# Altium schematic sheet Memory.SchDoc
size A; SheetNumber: 8; SheetTotal: 8
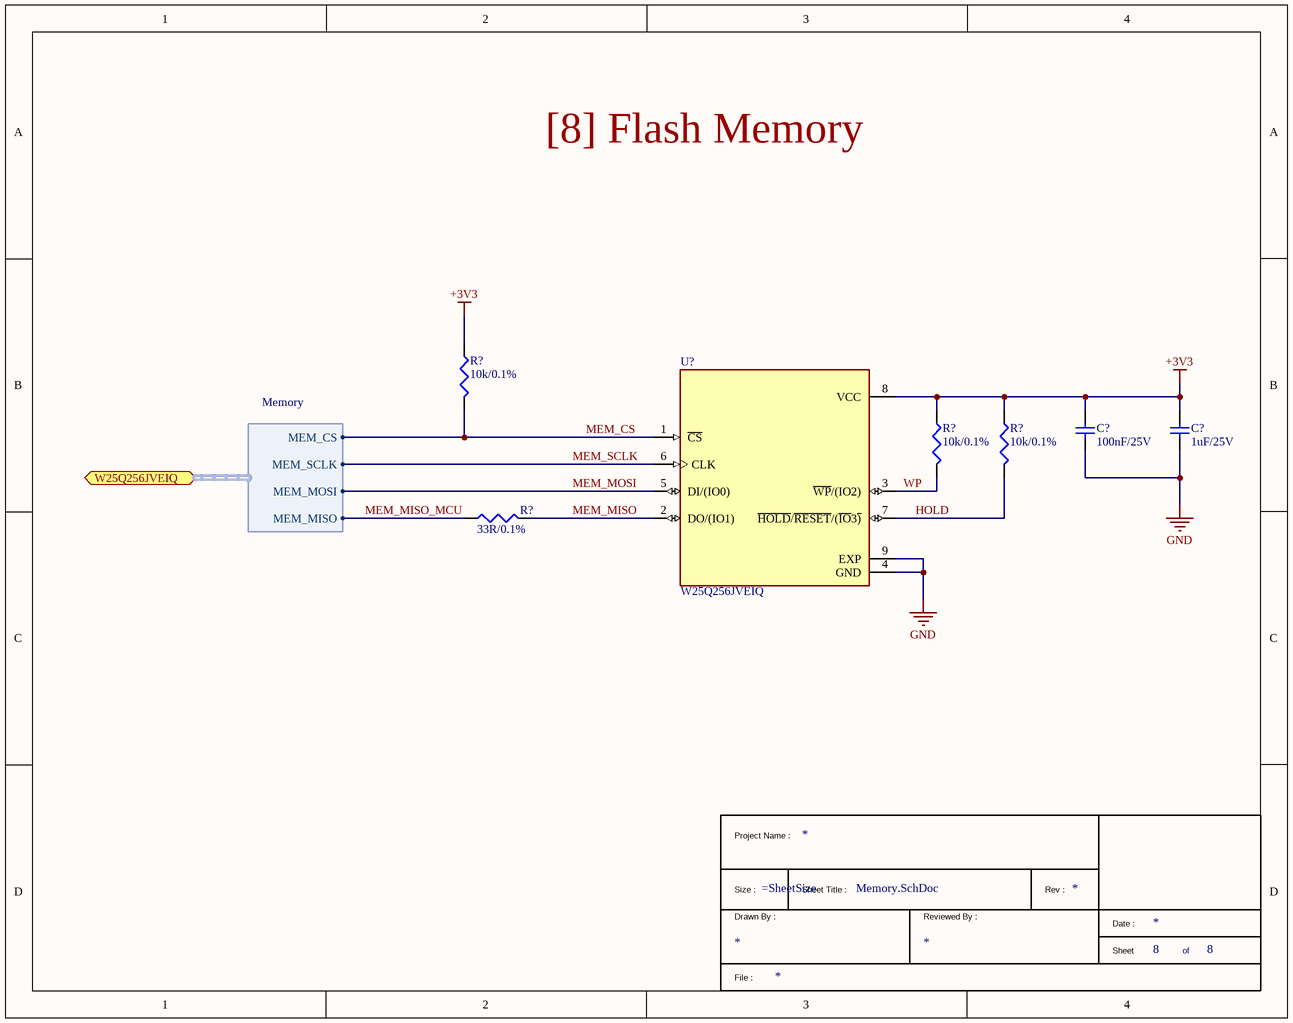
[diagram p0: Memory.SchDoc]

## Parts
(Parts that share a designator on the sheet are numbered #1, #2 ... from top to bottom, then left to right.)
*  TitleBlock1  (value not drawn)  (graphical)
C?#1  100nF/25V  [CAP_0402]
C?#2  1uF/25V  [CAP_0805]
R?#1  10k/0.1%  [RES_0402]
R?#2  10k/0.1%  [RES_0402]
R?#3  10k/0.1%  [RES_0402]
R?#4  33R/0.1%  [RES_0402]
U?  W25Q256JVEIQ  [W25Q256JVEIQ_WSON-8-EP(6x8)]

## Ports
W25Q256JVEIQ (bidir, harness Memory)

## Harnesses
Memory: MEM_SCLK, MEM_MOSI, MEM_CS, MEM_MISO

## Nets
+3V3: C?#1.2 C?#2.2 R?#1.1 R?#2.1 R?#3.1 U?.8(VCC)
GND: C?#1.1 C?#2.1 U?.4(GND) U?.9(EXP)
HOLD: R?#3.2 U?.7(~{HOLD}/~{RESET}/(~{IO}3~{)})
MEM_CS: R?#1.2 U?.1(~{CS}) ; port W25Q256JVEIQ.MEM_CS
MEM_MISO: R?#4.2 U?.2(DO/(IO1))
MEM_MISO_MCU: R?#4.1 ; port W25Q256JVEIQ.MEM_MISO
MEM_MOSI: U?.5(DI/(IO0)) ; port W25Q256JVEIQ.MEM_MOSI
MEM_SCLK: U?.6(CLK) ; port W25Q256JVEIQ.MEM_SCLK
WP: R?#2.2 U?.3(~{WP}/(IO2))

## Notes on the sheet
- [8] Flash Memory
- (in symbol TitleBlock1) Project Name :; Size :; Sheet Title :; Rev :; Drawn By :; Reviewed By :; Date :; Sheet; of; File :

## Library data of the parts
C?#1 = YAGEO CC0402JRX7R8BB104: 100nF ±5% 25V Ceramic Capacitor X7R 0402; Manufacturer: YAGEO; Manufacturer Part Number: CC0402JRX7R8BB104; LCSC Part Number: C541465; Package: 0402; Mounting Type: SMD; ComponentLink2Description: Digikey Link; ComponentLink3Description: LCSC Link; ComponentLink3URL: https://www.lcsc.com/product-detail/C541465.html?spm=wm.fly.bg.0.xh___wm.fly.dhl.mly.12-0-4&lcsc_vid=QlAIX1RQQQJfX1VRTwcNAQJXTlRaUQBVEQBYAwJfFFcxVlNRQFhYU1xWRFVdXztW
C?#2 = YAGEO CC0805KKX7R8BB105: 1uF ±10% 25V Ceramic Capacitor X7R 0805; Manufacturer: YAGEO; Manufacturer Part Number: CC0805KKX7R8BB105; LCSC Part Number: C91186; Package: 0805; Mounting Type: SMD; ComponentLink2Description: Digikey Link; ComponentLink3Description: LCSC Link; ComponentLink3URL: https://www.lcsc.com/product-detail/C91186.html?spm=wm.fly.bg.0.xh___wm.fly.dhl.mly.12-0-4&lcsc_vid=QlAIX1RQQQJfX1VRTwcNAQJXTlRaUQBVEQBYAwJfFFcxVlNRT1FbV1FfR1JZUDsOAxUeFF5JWBYZEEoKFBINSQcJGk4dAgUUFAk%3D
R?#1-R?#3 = YAGEO RT0402BRD0710KL: 62.5mW 10kΩ 50V Thin Film Resistor ±25ppm/℃ ±0.1% 0402 Chip Resistor - Surface Mount RoHS; Manufacturer: YAGEO; Manufacturer Part Number: RT0402BRD0710KL; LCSC Part Number: C190095; Package: 0402; ComponentLink1Description: Digikey Link; Mounting Type: SMD; ComponentLink2Description: LCSC Link; ComponentLink2URL: https://www.lcsc.com/product-detail/C190095.html?spm=wm.fly.bg.0.xh___wm.fly.dhl.mly.12-6-1&lcsc_vid=QlAIX1RQQQJfX1VRTwcNAQJXTlRaUQBVEQBYAwJfFFcxVlNRT1FbV1FfR1JZUDsOAxUeFF5JWBYZEEoKFBINSQcJGk4dAgUUFAk%3D
R?#4 = YAGEO RT0402BRD0733RL: 33Ω 63mW 50V Thin Film Resistor ±25ppm/℃ ±0.1% 0402 Chip Resistor - Surface Mount RoHS; Manufacturer: YAGEO; Manufacturer Part Number: RT0402BRD0733RL; LCSC Part Number: C852729; Package: 0402; ComponentLink1Description: Digikey Link; Mounting Type: SMD; ComponentLink2Description: LCSC Link; ComponentLink2URL: https://www.lcsc.com/product-detail/C852729.html?spm=wm.fly.bg.0.xh___wm.fly.dhl.mly.12-6-1&lcsc_vid=QlAIX1RQQQJfX1VRTwcNAQJXTlRaUQBVEQBYAwJfFFcxVlNRT1BXUFVTRlNXVDtW
U? = Winbond W25Q256JVEIQ: FLASH - NOR Memory IC 256Mbit SPI 133MHz WSON-8-EP(6x8); Manufacturer: Winbond; Manufacturer Part Number: W25Q256JVEIQ; LCSC Part Number: C97522; Package: WSON-8-EP(6x8); Mounting Type: SMD; ComponentLink2Description: Digikey Link; ComponentLink3Description: LCSC Link; ComponentLink3URL: https://www.lcsc.com/product-detail/C97522.html?s_z=n_q_C97522